# Altium schematic sheet периферия.SchDoc
size 420 x 297 mm; SheetNumber: 4; SheetTotal: 6
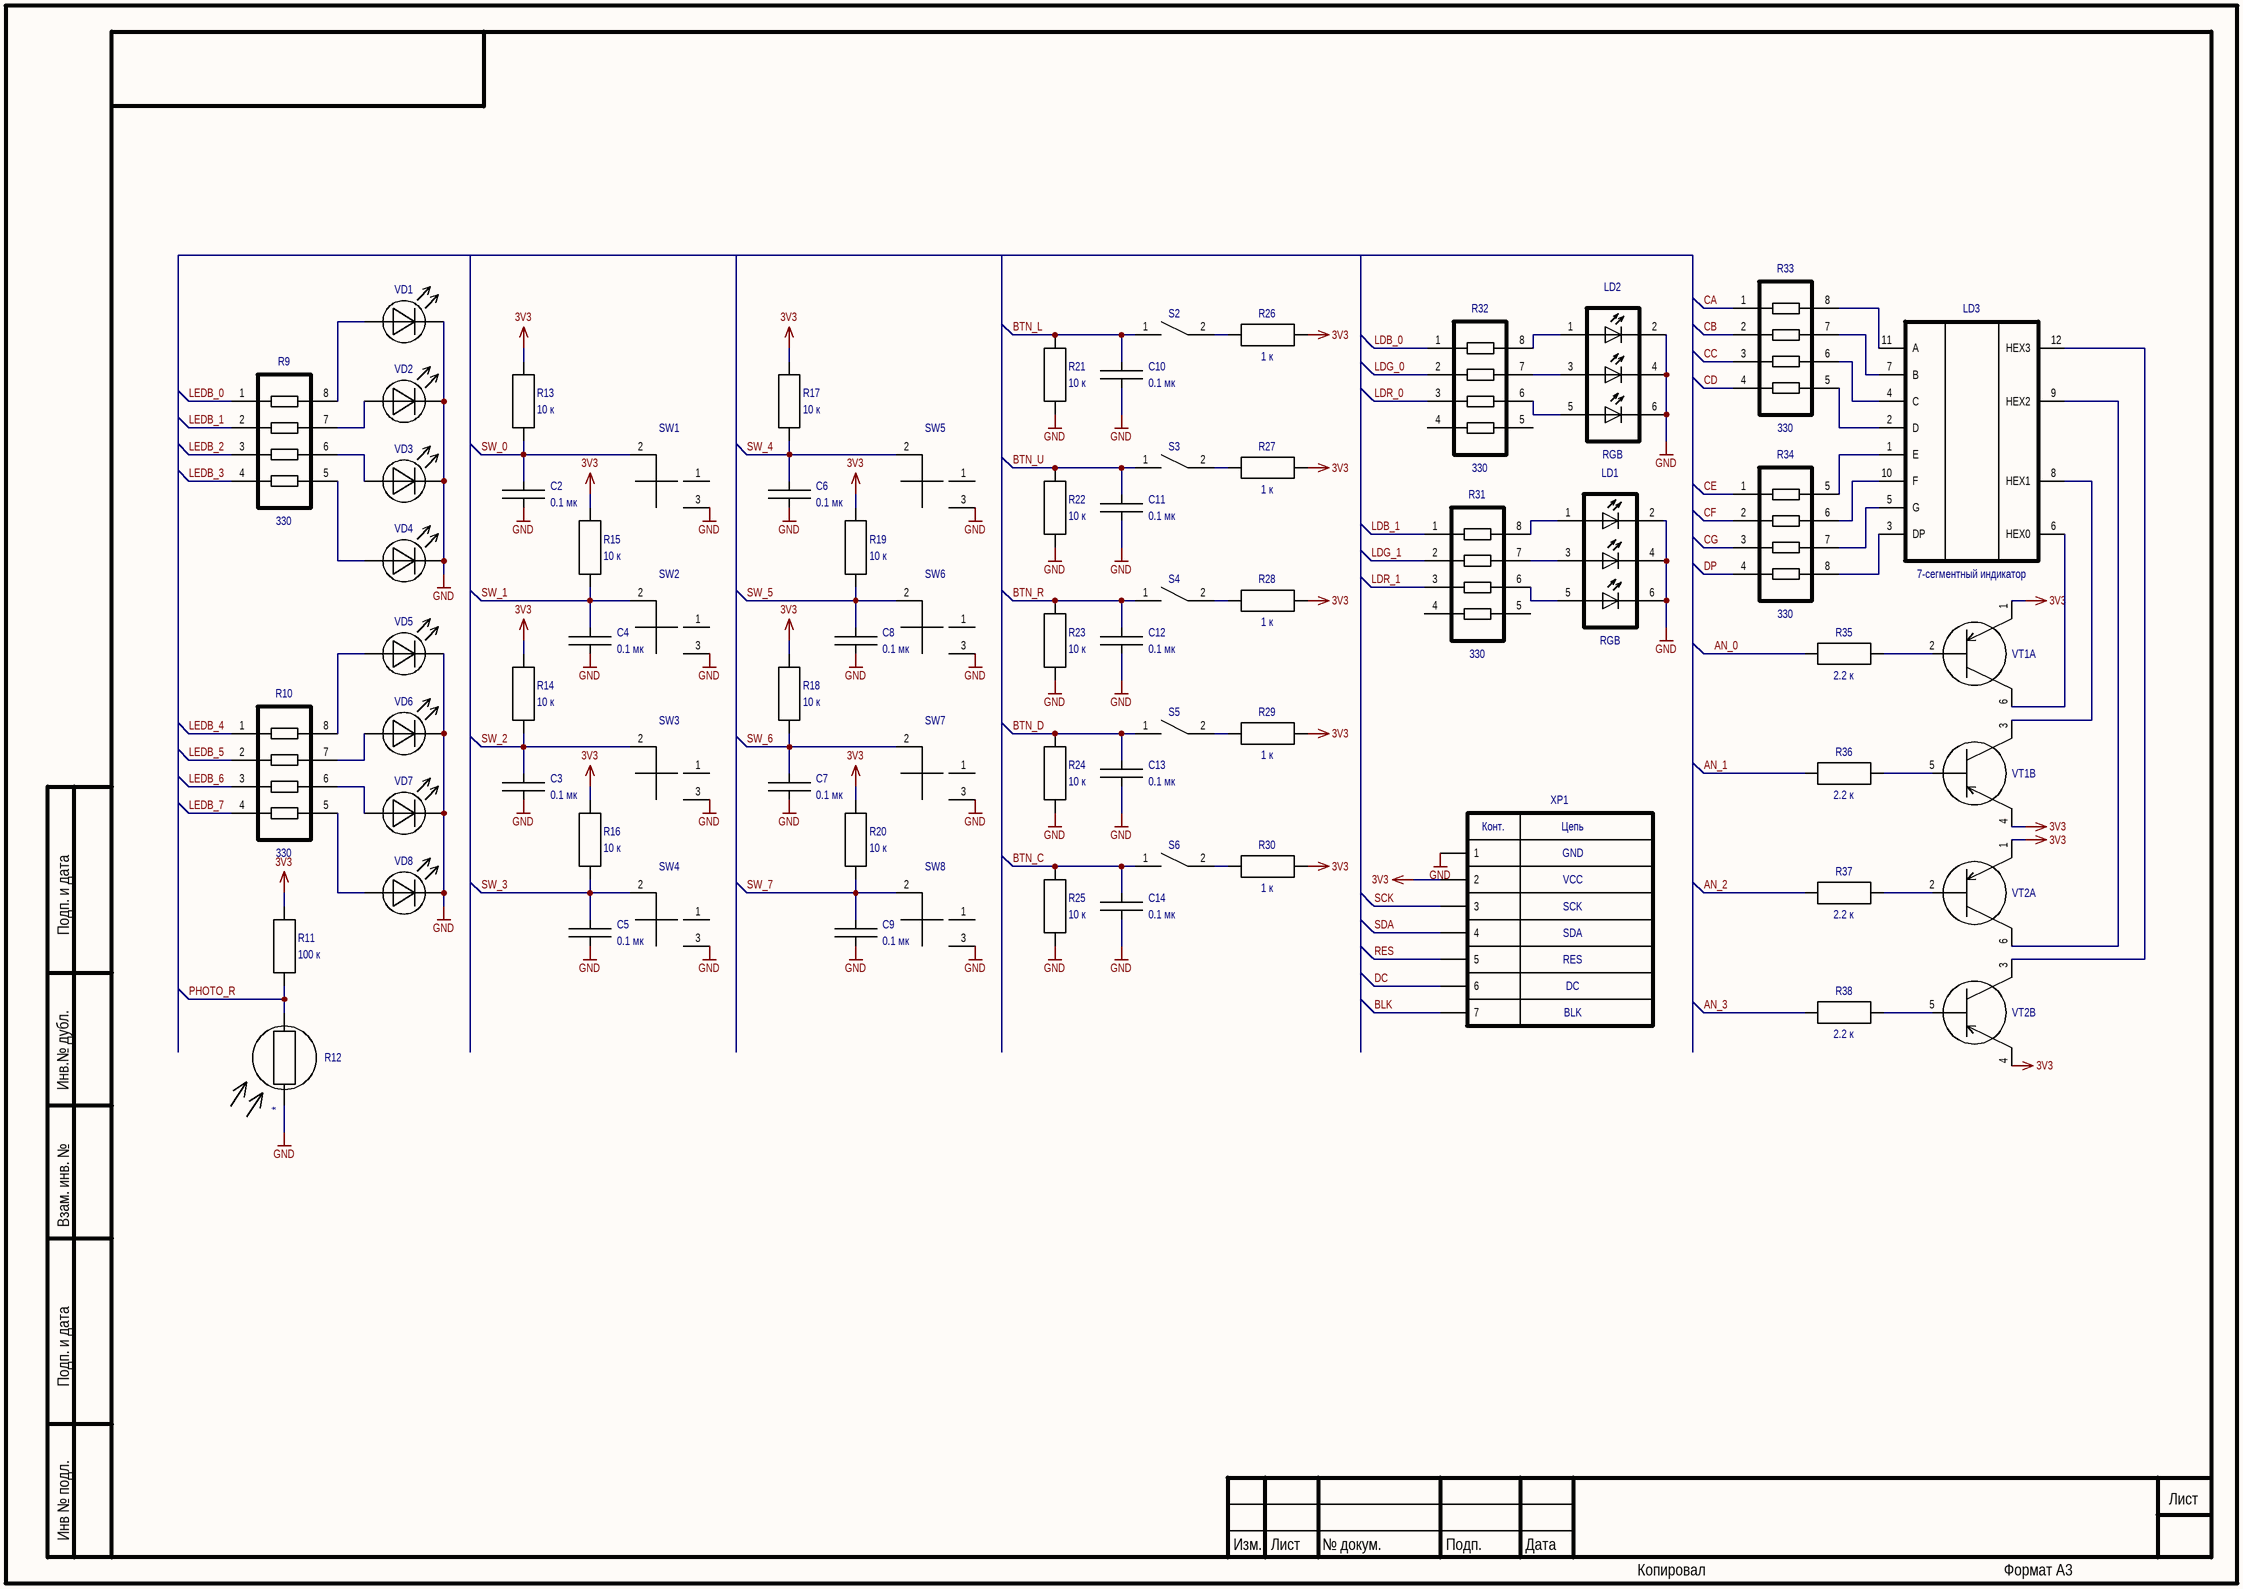
[diagram p0: периферия.SchDoc]

## Parts
C2  value 0.1 мк  [C0603]  (hidden comment: 0.1 мкФ ±* * * *, *)
C3  value 0.1 мк  [C0603]  (hidden comment: 0.1 мкФ ±* * * *, *)
C4  value 0.1 мк  [C0603]  (hidden comment: 0.1 мкФ ±* * * *, *)
C5  value 0.1 мк  [C0603]  (hidden comment: 0.1 мкФ ±* * * *, *)
C6  value 0.1 мк  [C0603]  (hidden comment: 0.1 мкФ ±* * * *, *)
C7  value 0.1 мк  [C0603]  (hidden comment: 0.1 мкФ ±* * * *, *)
C8  value 0.1 мк  [C0603]  (hidden comment: 0.1 мкФ ±* * * *, *)
C9  value 0.1 мк  [C0603]  (hidden comment: 0.1 мкФ ±* * * *, *)
C10  value 0.1 мк  [C0603]  (hidden comment: 0.1 мкФ ±* * * *, *)
C11  value 0.1 мк  [C0603]  (hidden comment: 0.1 мкФ ±* * * *, *)
C12  value 0.1 мк  [C0603]  (hidden comment: 0.1 мкФ ±* * * *, *)
C13  value 0.1 мк  [C0603]  (hidden comment: 0.1 мкФ ±* * * *, *)
C14  value 0.1 мк  [C0603]  (hidden comment: 0.1 мкФ ±* * * *, *)
LD1  RGB  [LED_150352M173300]
LD2  RGB  [LED_150352M173300]
LD3  value 7-сегментный индикатор  [PLD-12]  (hidden comment: 4042AS (TSOT-23) Linear Technology)
R9  330  [RESCAXE80P320X160X70-8N]
R10  330  [RESCAXE80P320X160X70-8N]
R11  value 100 к  [P1-12-0.1(0603)]
R12  (no value)  [PHODET_PDV-P8103]
R13  value 10 к  [P1-12-0.1(0603)]
R14  value 10 к  [P1-12-0.1(0603)]
R15  value 10 к  [P1-12-0.1(0603)]
R16  value 10 к  [P1-12-0.1(0603)]
R17  value 10 к  [P1-12-0.1(0603)]
R18  value 10 к  [P1-12-0.1(0603)]
R19  value 10 к  [P1-12-0.1(0603)]
R20  value 10 к  [P1-12-0.1(0603)]
R21  value 10 к  [P1-12-0.1(0603)]
R22  value 10 к  [P1-12-0.1(0603)]
R23  value 10 к  [P1-12-0.1(0603)]
R24  value 10 к  [P1-12-0.1(0603)]
R25  value 10 к  [P1-12-0.1(0603)]
R26  value 1 к  [P1-12-0.1(0603)]
R27  value 1 к  [P1-12-0.1(0603)]
R28  value 1 к  [P1-12-0.1(0603)]
R29  value 1 к  [P1-12-0.1(0603)]
R30  value 1 к  [P1-12-0.1(0603)]
R31  330  [RESCAXE80P320X160X70-8N]
R32  330  [RESCAXE80P320X160X70-8N]
R33  330  [RESCAXE80P320X160X70-8N]
R34  330  [RESCAXE80P320X160X70-8N]
R35  value 2.2 к  [P1-12-0.1(0603)]
R36  value 2.2 к  [P1-12-0.1(0603)]
R37  value 2.2 к  [P1-12-0.1(0603)]
R38  value 2.2 к  [P1-12-0.1(0603)]
S2  Тактильный переключатель KLS7-TS6604-4.3-180-B KLS  [SW_1825910-6-4]  (value not drawn)
S3  Тактильный переключатель KLS7-TS6604-4.3-180-B KLS  [SW_1825910-6-4]  (value not drawn)
S4  Тактильный переключатель KLS7-TS6604-4.3-180-B KLS  [SW_1825910-6-4]  (value not drawn)
S5  Тактильный переключатель KLS7-TS6604-4.3-180-B KLS  [SW_1825910-6-4]  (value not drawn)
S6  Тактильный переключатель KLS7-TS6604-4.3-180-B KLS  [SW_1825910-6-4]  (value not drawn)
SW1  SW_two  [MSS-22D18 MSS22D18G2]  (value not drawn)
SW2  SW_two  [MSS-22D18 MSS22D18G2]  (value not drawn)
SW3  SW_two  [MSS-22D18 MSS22D18G2]  (value not drawn)
SW4  SW_two  [MSS-22D18 MSS22D18G2]  (value not drawn)
SW5  SW_two  [MSS-22D18 MSS22D18G2]  (value not drawn)
SW6  SW_two  [MSS-22D18 MSS22D18G2]  (value not drawn)
SW7  SW_two  [MSS-22D18 MSS22D18G2]  (value not drawn)
SW8  SW_two  [MSS-22D18 MSS22D18G2]  (value not drawn)
VD1  Светодиод  [LED 0603]  (value not drawn)
VD2  Светодиод  [LED 0603]  (value not drawn)
VD3  Светодиод  [LED 0603]  (value not drawn)
VD4  Светодиод  [LED 0603]  (value not drawn)
VD5  Светодиод  [LED 0603]  (value not drawn)
VD6  Светодиод  [LED 0603]  (value not drawn)
VD7  Светодиод  [LED 0603]  (value not drawn)
VD8  Светодиод  [LED 0603]  (value not drawn)
VT1  2Т3129А9 (КТ-46А) АО.336.448ТУ / 02  [SOT-363]  (value not drawn)  (parts A,B of 2)
VT2  2Т3129А9 (КТ-46А) АО.336.448ТУ / 02  [SOT-363]  (value not drawn)  (parts A,B of 2)
XP1  2: VCC  1: GND  4: SDA  5: RES  6: DC  8: SCK  7: BLK  [PBS-7]  (hidden comment: KONT_POLE_8)

## Nets
3V3: R11.2 R13.1 R14.1 R15.1 R16.1 R17.1 R18.1 R19.1 R20.1 R26.2 R27.2 R28.2 R29.2 R30.2 VT1.1(E) VT1.4(E) VT2.1(E) VT2.4(E) XP1.2
GND: C2.1 C3.1 C4.1 C5.1 C6.1 C7.1 C8.1 C9.1 C10.1 C11.1 C12.1 C13.1 C14.1 LD1.2(B) LD1.4(R) LD1.6(G) LD2.2(B) LD2.4(R) LD2.6(G) R12.1 R21.2 R22.2 R23.2 R24.2 R25.2 SW1.3 SW2.3 SW3.3 SW4.3 SW5.3 SW6.3 SW7.3 SW8.3 VD1.2(C) VD2.2(C) VD3.2(C) VD4.2(C) VD5.2(C) VD6.2(C) VD7.2(C) VD8.2(C) XP1.1
AN_0: R35.2
AN_1: R36.2
AN_2: R37.2
AN_3: R38.2
BLK: XP1.7
BTN_C: C14.2 R25.1 S6.1
BTN_D: C13.2 R24.1 S5.1
BTN_L: C10.2 R21.1 S2.1
BTN_R: C12.2 R23.1 S4.1
BTN_U: C11.2 R22.1 S3.1
CA: R33.1(B)
CB: R33.2(B)
CC: R33.3(B)
CD: R33.4(B)
CE: R34.1(B)
CF: R34.2(B)
CG: R34.3(B)
DC: XP1.6
DP: R34.4(B)
LDB_0: R32.1(B)
LDB_1: R31.1(B)
LDG_0: R32.2(B)
LDG_1: R31.2(B)
LDR_0: R32.3(B)
LDR_1: R31.3(B)
LEDB_0: R9.1(B)
LEDB_1: R9.2(B)
LEDB_2: R9.3(B)
LEDB_3: R9.4(B)
LEDB_4: R10.1(B)
LEDB_5: R10.2(B)
LEDB_6: R10.3(B)
LEDB_7: R10.4(B)
PHOTO_R: R11.1 R12.2
RES: XP1.5
SCK: XP1.3
SDA: XP1.4
SW_0: C2.2 R13.2 SW1.2
SW_1: C4.2 R15.2 SW2.2
SW_2: C3.2 R14.2 SW3.2
SW_3: C5.2 R16.2 SW4.2
SW_4: C6.2 R17.2 SW5.2
SW_5: C8.2 R19.2 SW6.2
SW_6: C7.2 R18.2 SW7.2
SW_7: C9.2 R20.2 SW8.2
NetLD1_1: LD1.1(B) R31.8(B)
NetLD1_3: LD1.3(R) R31.7(B)
NetLD1_5: LD1.5(G) R31.6(B)
NetLD2_1: LD2.1(B) R32.8(B)
NetLD2_3: LD2.3(R) R32.7(B)
NetLD2_5: LD2.5(G) R32.6(B)
NetLD3_1: LD3.1(E) R34.5(B)
NetLD3_2: LD3.2(D) R33.5(B)
NetLD3_3: LD3.3(DP) R34.8(B)
NetLD3_4: LD3.4(C) R33.6(B)
NetLD3_5: LD3.5(G) R34.7(B)
NetLD3_6: LD3.6(HEX0) VT1.6(K)
NetLD3_7: LD3.7(B) R33.7(B)
NetLD3_8: LD3.8(HEX1) VT1.3(K)
NetLD3_9: LD3.9(HEX2) VT2.6(K)
NetLD3_10: LD3.10(F) R34.6(B)
NetLD3_11: LD3.11(A) R33.8(B)
NetLD3_12: LD3.12(HEX3) VT2.3(K)
NetR9_5: R9.5(B) VD4.1(A)
NetR9_6: R9.6(B) VD3.1(A)
NetR9_7: R9.7(B) VD2.1(A)
NetR9_8: R9.8(B) VD1.1(A)
NetR10_5: R10.5(B) VD8.1(A)
NetR10_6: R10.6(B) VD7.1(A)
NetR10_7: R10.7(B) VD6.1(A)
NetR10_8: R10.8(B) VD5.1(A)
NetR26_1: R26.1 S2.2
NetR27_1: R27.1 S3.2
NetR28_1: R28.1 S4.2
NetR29_1: R29.1 S5.2
NetR30_1: R30.1 S6.2
NetR35_1: R35.1 VT1.2(B)
NetR36_1: R36.1 VT1.5(B)
NetR37_1: R37.1 VT2.2(B)
NetR38_1: R38.1 VT2.5(B)

Not connected (* = marked no-connect by the designer): R31 4(B) 5(B); R32 4(B) 5(B); SW1 1; SW2 1; SW3 1; SW4 1; SW5 1; SW6 1; SW7 1; SW8 1

## Notes on the sheet
- Подп. и дата
- Инв.№ дубл.
- Взам. инв. №
- Инв № подл.
- Изм.
- Лист
- № докум.
- Подп.
- Дата
- Копировал
- Формат А3
- (in symbol KONT_POLE_8_1) Конт.; Цепь

## Library data of the parts
C2-C14 = C: Company: *; PartNumber: *; Tolerance: *; Voltage: *; Type: *; Package: *
LD3 = 7-сегментный индикатор: Company: Linear Technology; PartNumber: 4042AS; Package: TSOT-23
R9 R10 R31-R33 = R330
R11 R26-R30 R35-R38 = R: Company: *; PartNumber: *; Package: *; Tolerance: *
R12 = R_3: Company: *; PartNumber: *; Package: *; Tolerance: *; Value: *
R13-R25 = R_1: Company: *; PartNumber: *; Package: *; Tolerance: *
R34 = R330: pin to pad: 5>8 6>7 7>6 8>5
S2-S6 = BTN: Company: KLS; PartNumber: KLS7-TS6604-4.3-180-B
VT1 VT2 = 2Т3129_1_1: NameCompany: Интеграл; Body: КТ-46А; TU: АО.336.448ТУ / 02; Value: 2Т3129А9; Family: Транзистор; PartNumber: 2Т3129А9; Name: 2Т3129А9
XP1 = KONT_POLE_8_1